# Altium schematic sheet Top_Level_MCU.SchDoc
size A; SheetNumber: 1; SheetTotal: 5
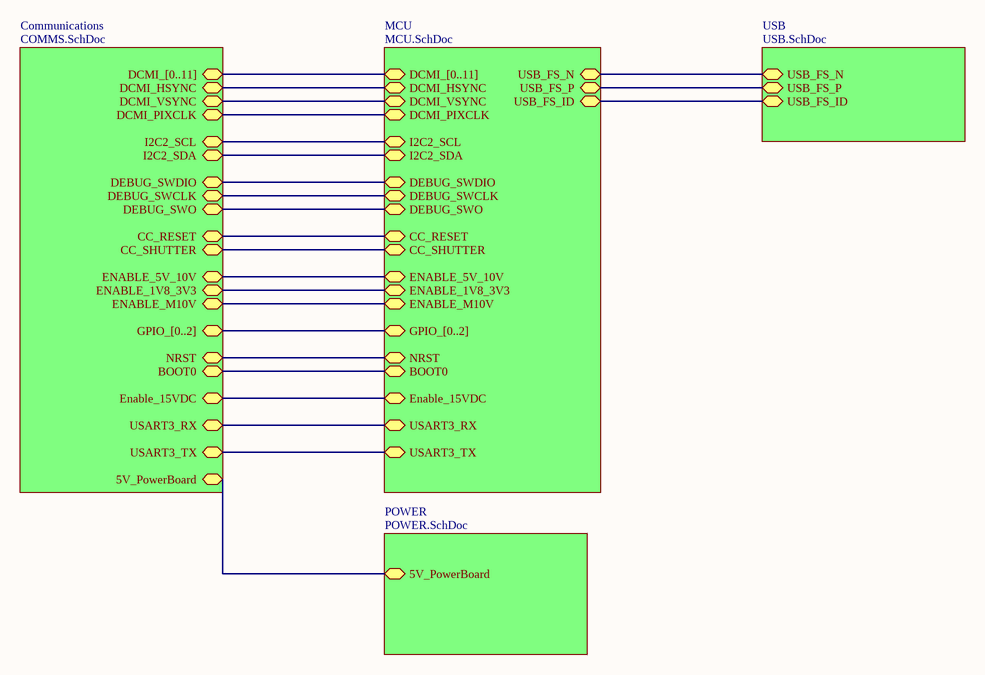
[diagram p0: Top_Level_MCU.SchDoc]

## Sub-sheets
Communications = COMMS.SchDoc: DCMI_[0..11] (bidir), DCMI_HSYNC (bidir), DCMI_VSYNC (bidir), DCMI_PIXCLK (bidir), I2C2_SCL (bidir), I2C2_SDA (bidir), DEBUG_SWDIO (bidir), DEBUG_SWCLK (bidir), DEBUG_SWO (bidir), CC_RESET (bidir), CC_SHUTTER (bidir), ENABLE_5V_10V (bidir), ENABLE_1V8_3V3 (bidir), ENABLE_M10V (bidir), GPIO_[0..2] (bidir), NRST (bidir), BOOT0 (bidir), Enable_15VDC (bidir), USART3_RX (bidir), USART3_TX (bidir), 5V_PowerBoard (bidir)
MCU = MCU.SchDoc: USB_FS_N (bidir), USB_FS_P (bidir), USB_FS_ID (bidir), DCMI_[0..11] (bidir), DCMI_HSYNC (bidir), DCMI_VSYNC (bidir), DCMI_PIXCLK (bidir), I2C2_SCL (bidir), I2C2_SDA (bidir), DEBUG_SWDIO (bidir), DEBUG_SWCLK (bidir), DEBUG_SWO (bidir), CC_RESET (bidir), CC_SHUTTER (bidir), ENABLE_5V_10V (bidir), ENABLE_1V8_3V3 (bidir), ENABLE_M10V (bidir), GPIO_[0..2] (bidir), NRST (bidir), BOOT0 (bidir), Enable_15VDC (bidir), USART3_RX (bidir), USART3_TX (bidir)
POWER = POWER.SchDoc: 5V_PowerBoard (bidir)
USB = USB.SchDoc: USB_FS_N (bidir), USB_FS_P (bidir), USB_FS_ID (bidir)

## Nets
(unnamed): sheet MCU/USB_FS_N, sheet USB/USB_FS_N
(unnamed): sheet MCU/USB_FS_P, sheet USB/USB_FS_P
(unnamed): sheet MCU/USB_FS_ID, sheet USB/USB_FS_ID
(unnamed): sheet MCU/DCMI_HSYNC, sheet Communications/DCMI_HSYNC
(unnamed): sheet MCU/DCMI_VSYNC, sheet Communications/DCMI_VSYNC
(unnamed): sheet MCU/DCMI_PIXCLK, sheet Communications/DCMI_PIXCLK
(unnamed): sheet MCU/I2C2_SCL, sheet Communications/I2C2_SCL
(unnamed): sheet MCU/I2C2_SDA, sheet Communications/I2C2_SDA
(unnamed): sheet MCU/DEBUG_SWDIO, sheet Communications/DEBUG_SWDIO
(unnamed): sheet MCU/DEBUG_SWCLK, sheet Communications/DEBUG_SWCLK
(unnamed): sheet MCU/DEBUG_SWO, sheet Communications/DEBUG_SWO
(unnamed): sheet MCU/CC_RESET, sheet Communications/CC_RESET
(unnamed): sheet MCU/CC_SHUTTER, sheet Communications/CC_SHUTTER
(unnamed): sheet MCU/ENABLE_5V_10V, sheet Communications/ENABLE_5V_10V
(unnamed): sheet MCU/ENABLE_1V8_3V3, sheet Communications/ENABLE_1V8_3V3
(unnamed): sheet MCU/ENABLE_M10V, sheet Communications/ENABLE_M10V
(unnamed): sheet MCU/NRST, sheet Communications/NRST
(unnamed): sheet MCU/BOOT0, sheet Communications/BOOT0
(unnamed): sheet MCU/Enable_15VDC, sheet Communications/Enable_15VDC
(unnamed): sheet MCU/USART3_RX, sheet Communications/USART3_RX
(unnamed): sheet MCU/USART3_TX, sheet Communications/USART3_TX
(unnamed): sheet Communications/5V_PowerBoard, sheet POWER/5V_PowerBoard

## Buses and harness runs
bus sheet Communications/DCMI_[0..11] = sheet MCU/DCMI_[0..11]
bus sheet Communications/GPIO_[0..2] = sheet MCU/GPIO_[0..2]